# EAGLE schematic board (EAGLE 6.4)
Assembly variants: test
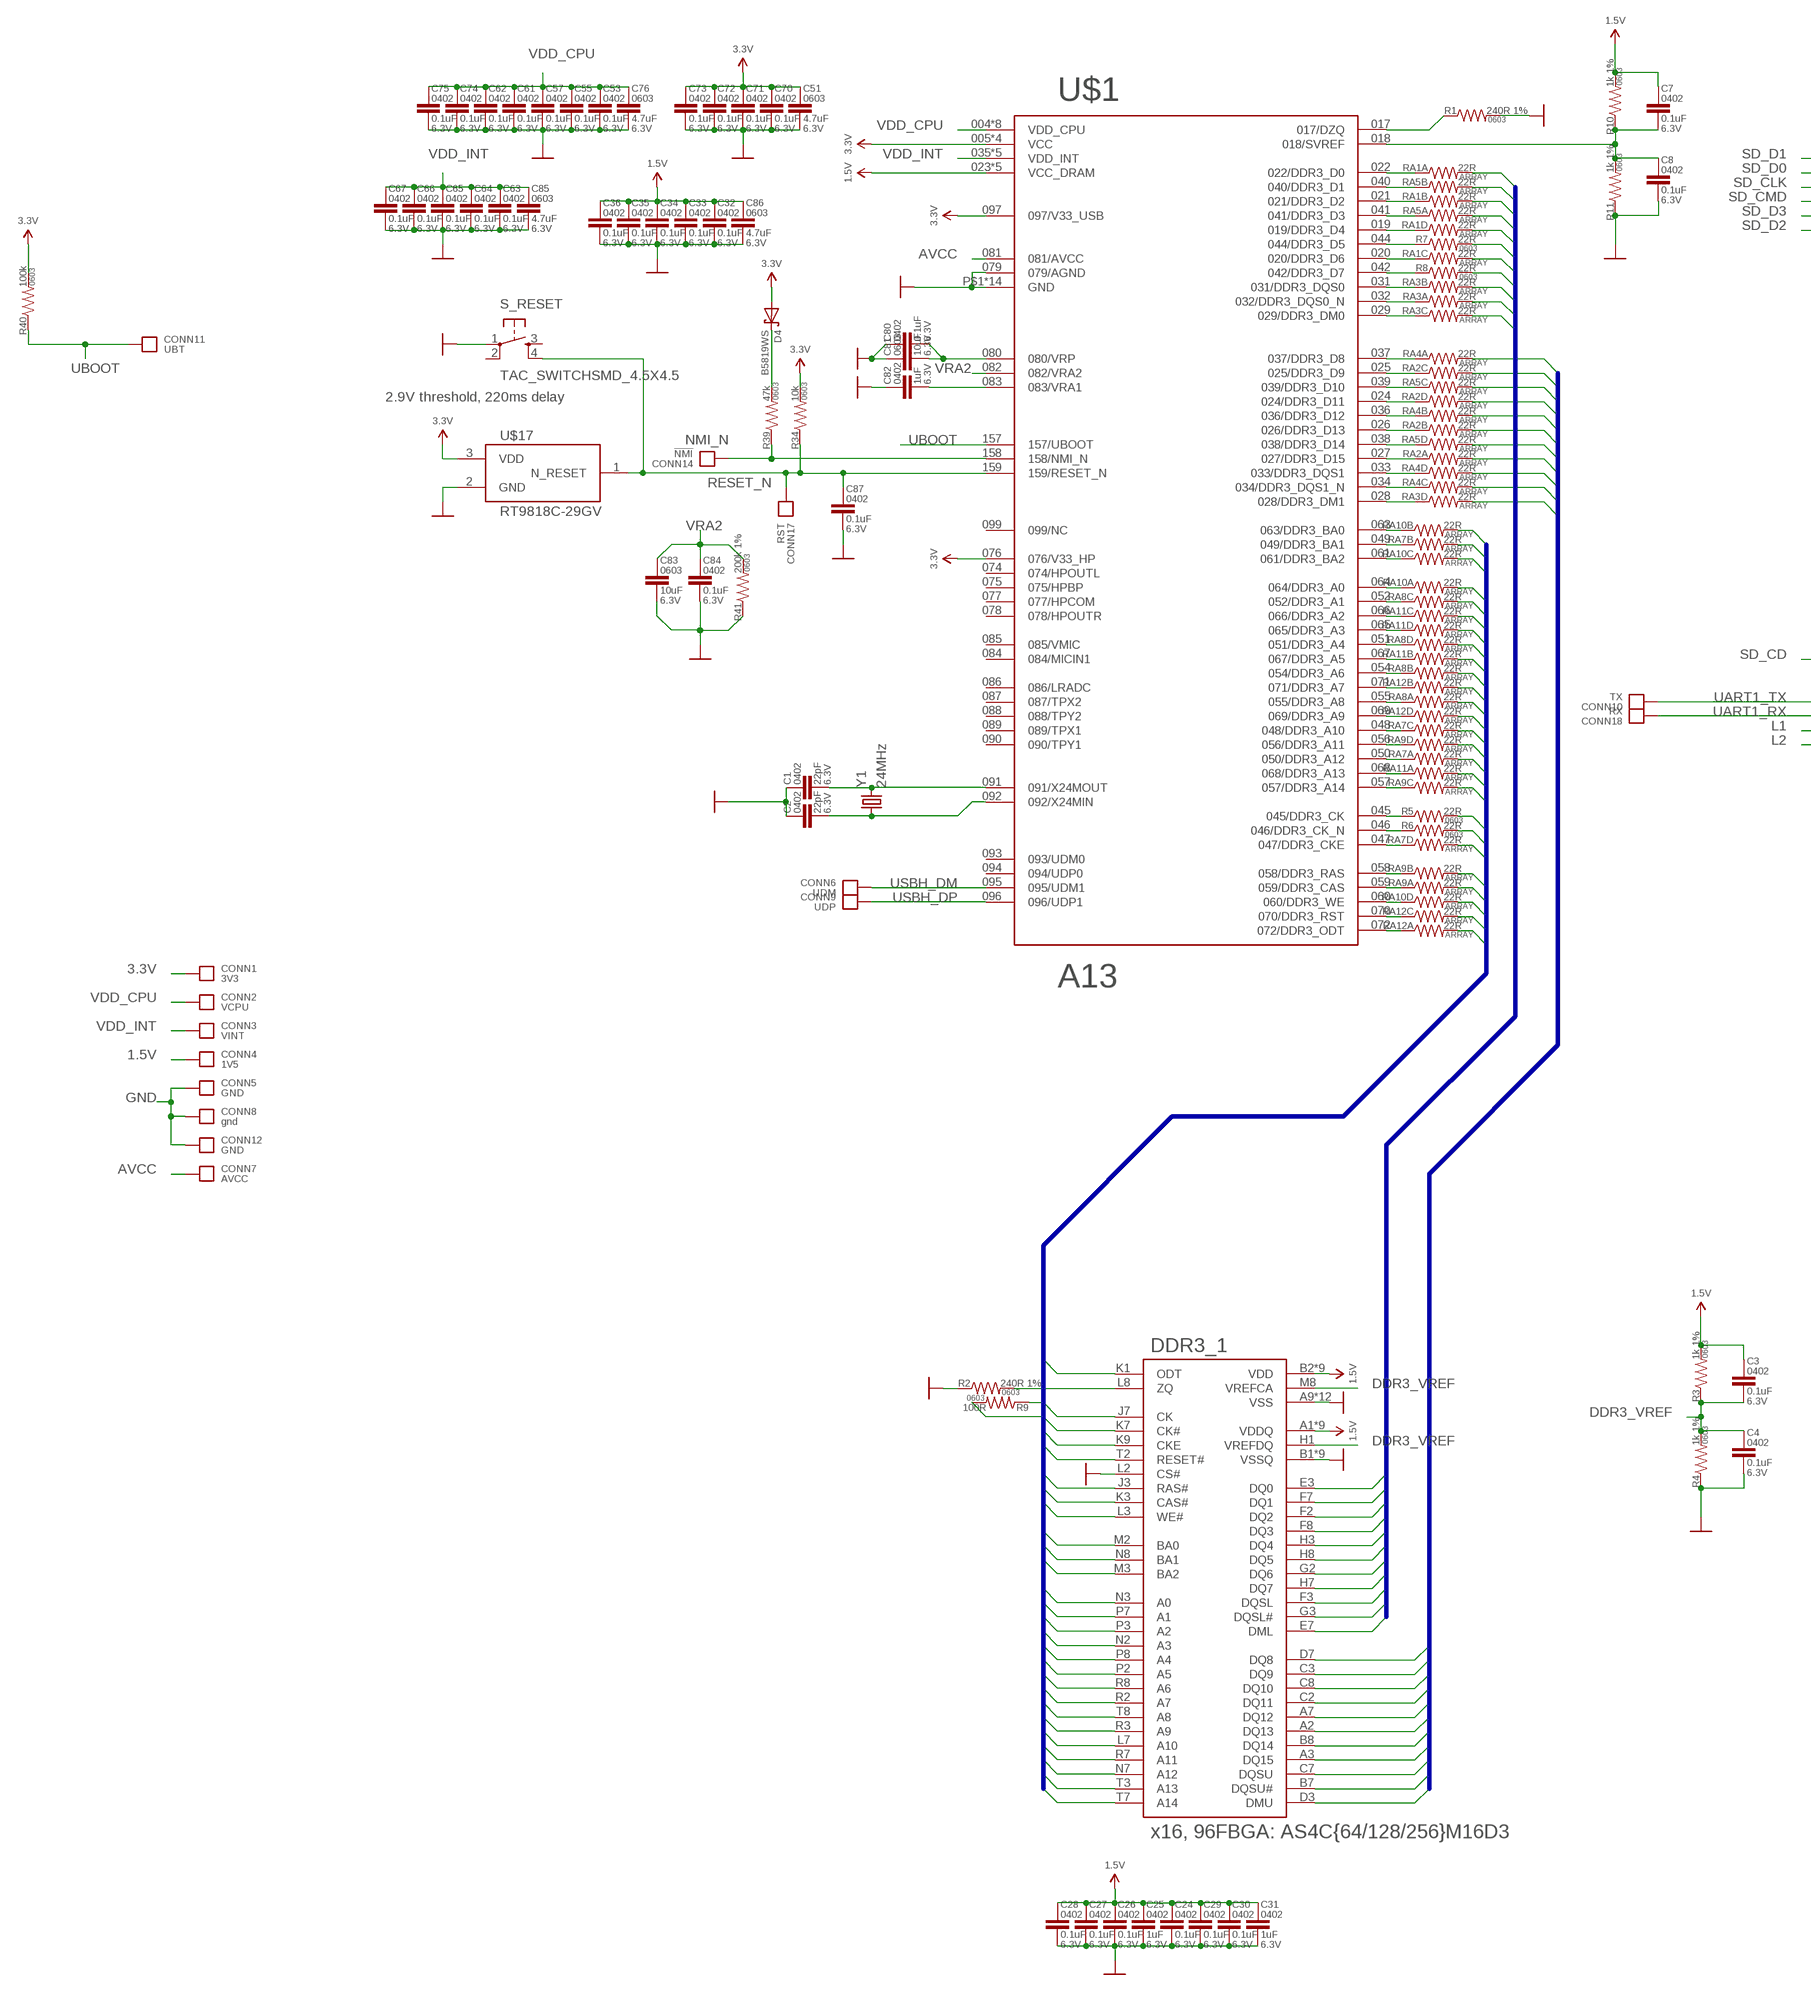
[diagram p0: schematic, sheet 1, part 1 of 2]
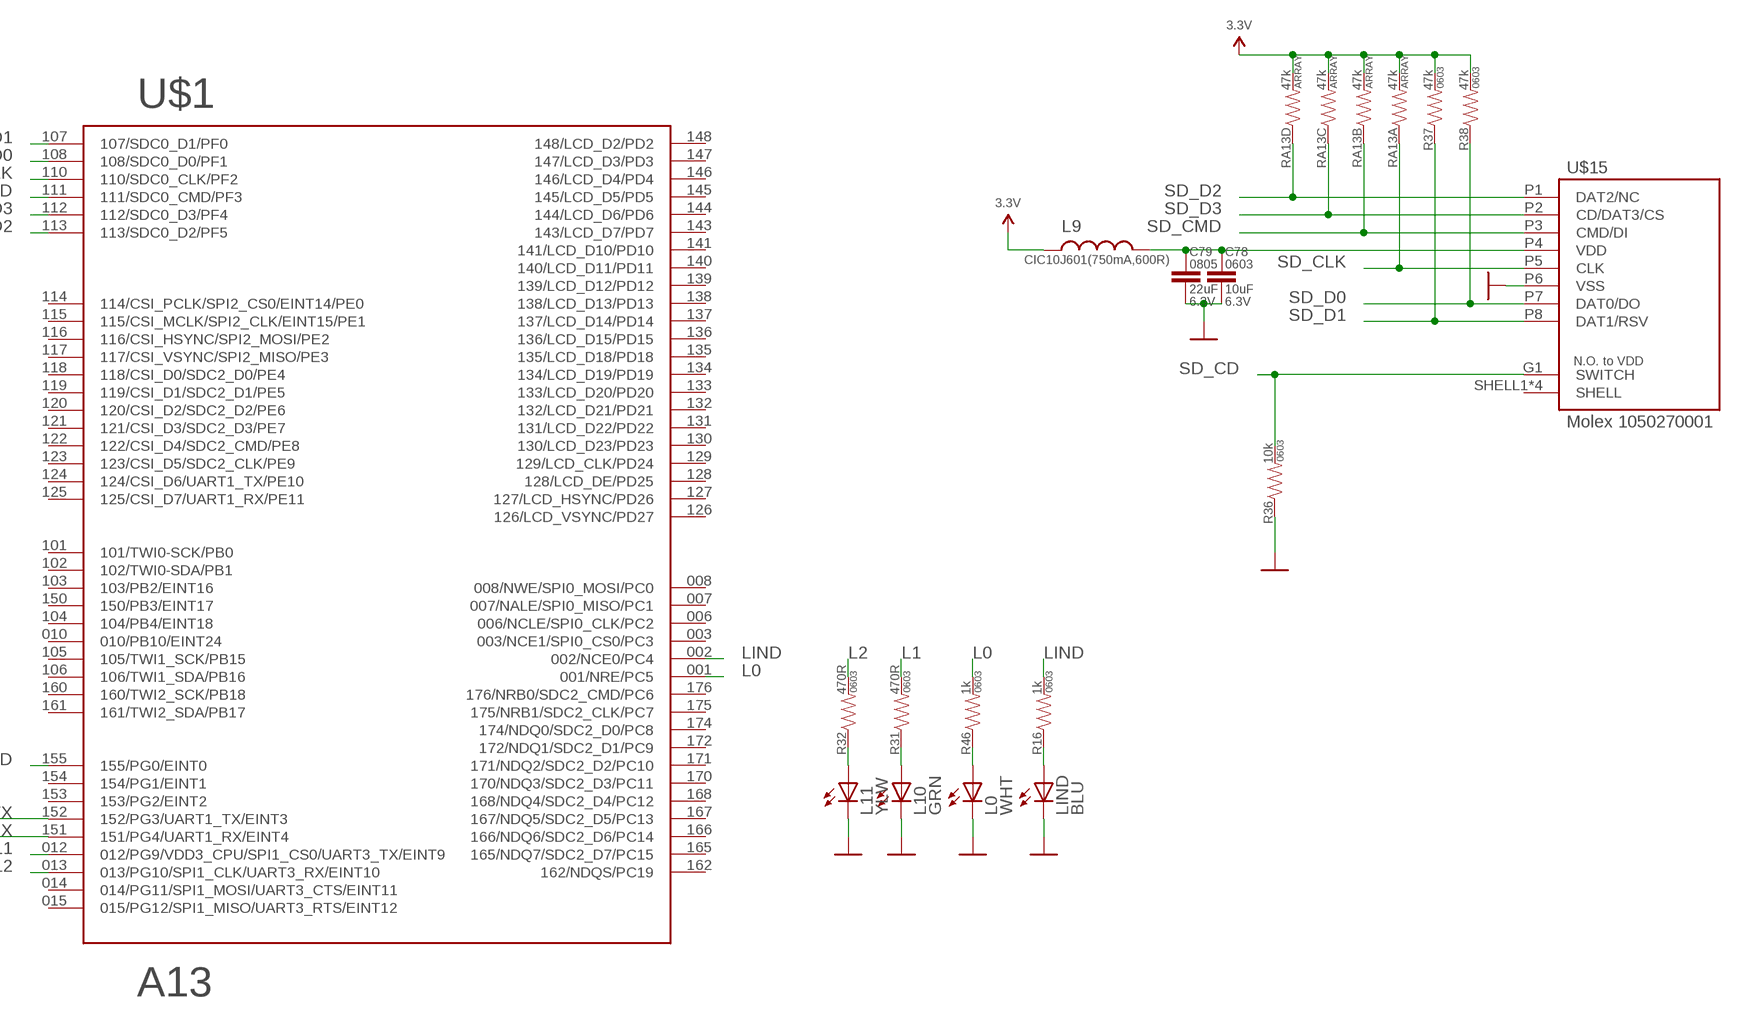
[diagram p1: schematic, sheet 1, part 2 of 2]

## Parts
C1  22pF  CAP0402-CAP  [0402-CAP]
C2  22pF  CAP0402-CAP  [0402-CAP]
C3  0.1uF  CAP0402-CAP  [0402-CAP]
C4  0.1uF  CAP0402-CAP  [0402-CAP]
C7  0.1uF  CAP0402-CAP  [0402-CAP]
C8  0.1uF  CAP0402-CAP  [0402-CAP]
C24  0.1uF  CAP0402-CAP  [0402-CAP]
C25  1uF  CAP0402-CAP  [0402-CAP]
C26  0.1uF  CAP0402-CAP  [0402-CAP]
C27  0.1uF  CAP0402-CAP  [0402-CAP]
C28  0.1uF  CAP0402-CAP  [0402-CAP]
C29  0.1uF  CAP0402-CAP  [0402-CAP]
C30  0.1uF  CAP0402-CAP  [0402-CAP]
C31  1uF  CAP0402-CAP  [0402-CAP]
C32  0.1uF  CAP0402-CAP  [0402-CAP]
C33  0.1uF  CAP0402-CAP  [0402-CAP]
C34  0.1uF  CAP0402-CAP  [0402-CAP]
C35  0.1uF  CAP0402-CAP  [0402-CAP]
C36  0.1uF  CAP0402-CAP  [0402-CAP]
C51  4.7uF  CAP0603  [0603-CAP]
C53  0.1uF  CAP0402-CAP  [0402-CAP]
C55  0.1uF  CAP0402-CAP  [0402-CAP]
C57  0.1uF  CAP0402-CAP  [0402-CAP]
C61  0.1uF  CAP0402-CAP  [0402-CAP]
C62  0.1uF  CAP0402-CAP  [0402-CAP]
C63  0.1uF  CAP0402-CAP  [0402-CAP]
C64  0.1uF  CAP0402-CAP  [0402-CAP]
C65  0.1uF  CAP0402-CAP  [0402-CAP]
C66  0.1uF  CAP0402-CAP  [0402-CAP]
C67  0.1uF  CAP0402-CAP  [0402-CAP]
C70  0.1uF  CAP0402-CAP  [0402-CAP]
C71  0.1uF  CAP0402-CAP  [0402-CAP]
C72  0.1uF  CAP0402-CAP  [0402-CAP]
C73  0.1uF  CAP0402-CAP  [0402-CAP]
C74  0.1uF  CAP0402-CAP  [0402-CAP]
C75  0.1uF  CAP0402-CAP  [0402-CAP]
C76  4.7uF  CAP0603  [0603-CAP]
C78  10uF  CAP0603  [0603-CAP]
C79  22uF  CAP0805  [0805-CAP]
C80  0.1uF  CAP0402-CAP  [0402-CAP]
C81  10uF  CAP0603  [0603-CAP]
C82  1uF  CAP0402-CAP  [0402-CAP]
C83  10uF  CAP0603  [0603-CAP]
C84  0.1uF  CAP0402-CAP  [0402-CAP]
C85  4.7uF  CAP0603  [0603-CAP]
C86  4.7uF  CAP0603  [0603-CAP]
C87  0.1uF  CAP0402-CAP  [0402-CAP]
CONN1  3V3  CONNECTOR22AWG  [HOLE_22AWG]
CONN2  VCPU  CONNECTOR22AWG  [HOLE_22AWG]
CONN3  VINT  CONNECTOR22AWG  [HOLE_22AWG]
CONN4  1V5  CONNECTOR22AWG  [HOLE_22AWG]
CONN5  GND  CONNECTOR22AWG  [HOLE_22AWG]
CONN6  UDM  CONNECTOR22AWG  [HOLE_22AWG]
CONN7  AVCC  CONNECTOR22AWG  [HOLE_22AWG]
CONN8  gnd  CONNECTORCLIP  [CLIP-AREA]
CONN9  UDP  CONNECTOR22AWG  [HOLE_22AWG]
CONN10  TX  CONNECTOR22AWG  [HOLE_22AWG]
CONN11  UBT  CONNECTOR22AWG  [HOLE_22AWG]
CONN12  GND  CONNECTOR22AWG  [HOLE_22AWG]
CONN14  !NMI  CONNECTOR22AWG  [HOLE_22AWG]
CONN17  RST  CONNECTOR22AWG  [HOLE_22AWG]
CONN18  RX  CONNECTOR22AWG  [HOLE_22AWG]
D4  B5819WS  DIODE-SCHOTTKYSOD323  [SOD-323]
DDR3_1  x16, 96FBGA: AS4C{64/128/256}M16D3  DDR3X16  [BGA96]
L0  WHT  LED0603  [0603_LED]
L9  CIC10J601(750mA,600R)  INDUCTOR0603  [0603]
L10  GRN  LED0603  [0603_LED]
L11  YLW  LED0603  [0603_LED]
LIND  BLU  LED0603  [0603_LED]
R1  240R 1%  RESISTOR0603  [0603-RES]
R2  240R 1%  RESISTOR0603  [0603-RES]
R3  1k 1%  RESISTOR0603  [0603-RES]
R4  1k 1%  RESISTOR0603  [0603-RES]
R5  22R  RESISTOR0603  [0603-RES]
R6  22R  RESISTOR0603  [0603-RES]
R7  22R  RESISTOR0603  [0603-RES]
R8  22R  RESISTOR0603  [0603-RES]
R9  100R  RESISTOR0603  [0603-RES]
R10  1k 1%  RESISTOR0603  [0603-RES]
R11  1k 1%  RESISTOR0603  [0603-RES]
R16  1k  RESISTOR0603  [0603-RES]
R31  470R  RESISTOR0603  [0603-RES]
R32  470R  RESISTOR0603  [0603-RES]
R34  10k  RESISTOR0603  [0603-RES]
R36  10k  RESISTOR0603  [0603-RES]
R37  47k  RESISTOR0603  [0603-RES]
R38  47k  RESISTOR0603  [0603-RES]
R39  47k  RESISTOR0603  [0603-RES]
R40  100k  RESISTOR0603  [0603-RES]
R41  200k 1%  RESISTOR0603  [0603-RES]
R46  1k  RESISTOR0603  [0603-RES]
RA1  22R  RESISTOR_ARRAY0603_X4  [0603-ARV]
RA2  22R  RESISTOR_ARRAY0603_X4  [0603-ARV]
RA3  22R  RESISTOR_ARRAY0603_X4  [0603-ARV]
RA4  22R  RESISTOR_ARRAY0603_X4  [0603-ARV]
RA5  22R  RESISTOR_ARRAY0603_X4  [0603-ARV]
RA7  22R  RESISTOR_ARRAY0603_X4  [0603-ARV]
RA8  22R  RESISTOR_ARRAY0603_X4  [0603-ARV]
RA9  22R  RESISTOR_ARRAY0603_X4  [0603-ARV]
RA10  22R  RESISTOR_ARRAY0603_X4  [0603-ARV]
RA11  22R  RESISTOR_ARRAY0603_X4  [0603-ARV]
RA12  22R  RESISTOR_ARRAY0603_X4  [0603-ARV]
RA13  47k  RESISTOR_ARRAY0603_X4  [0603-ARV]
S_RESET  TAC_SWITCHSMD_4.5X4.5  [TAC_SWITCH_SMD_4.5X4.5]
U$1  A13  [TQFP176_0.4]
U$15  Molex 1050270001  MICROSDMOLEX-1050270001  [MICROSD-MOLEX-1050270001]
U$17  RT9818C-29GV  POR_ACTIVE_LOW  [SOT23-3]
Y1  24MHz  CRYSTALHC49US  [HC49US]

## Nets
1.5V: C3.1 C7.1 C24.1 C25.1 C26.1 C27.1 C28.1 C29.1 C30.1 C31.1 C32.1 C33.1 C34.1 C35.1 C36.1 C86.1 CONN4.P DDR3_1.A1(VDDQ) DDR3_1.A8(VDDQ) DDR3_1.B2(VDD) DDR3_1.C1(VDDQ) DDR3_1.C9(VDDQ) DDR3_1.D2(VDDQ) DDR3_1.D9(VDD) DDR3_1.E9(VDDQ) DDR3_1.F1(VDDQ) DDR3_1.G7(VDD) DDR3_1.H2(VDDQ) DDR3_1.H9(VDDQ) DDR3_1.K2(VDD) DDR3_1.K8(VDD) DDR3_1.N1(VDD) DDR3_1.N9(VDD) DDR3_1.R1(VDD) DDR3_1.R9(VDD) R3.2 R10.2 U$1.023(VCC_DRAM) U$1.030(VCC_DRAM) U$1.043(VCC_DRAM) U$1.053(VCC_DRAM) U$1.062(VCC_DRAM)
3.3V: C51.1 C70.1 C71.1 C72.1 C73.1 CONN1.P D4.A L9.1 R34.2 R37.2 R38.2 R40.2 RA13.5 RA13.6 RA13.7 RA13.8 U$1.005(VCC) U$1.076(076/V33_HP) U$1.097(097/V33_USB) U$1.100(VCC) U$1.142(VCC) U$1.163(VCC) U$17.3(VDD)
AVCC: CONN7.P U$1.081(081/AVCC)
DDR3_A0: DDR3_1.N3(A0) RA10.8
DDR3_A1: DDR3_1.P7(A1) RA8.6
DDR3_A2: DDR3_1.P3(A2) RA11.6
DDR3_A3: DDR3_1.N2(A3) RA11.5
DDR3_A4: DDR3_1.P8(A4) RA8.5
DDR3_A5: DDR3_1.P2(A5) RA11.7
DDR3_A6: DDR3_1.R8(A6) RA8.7
DDR3_A7: DDR3_1.R2(A7) RA12.7
DDR3_A8: DDR3_1.T8(A8) RA8.8
DDR3_A9: DDR3_1.R3(A9) RA12.5
DDR3_A10: DDR3_1.L7(A10) RA7.6
DDR3_A11: DDR3_1.R7(A11) RA9.5
DDR3_A12: DDR3_1.N7(A12) RA7.8
DDR3_A13: DDR3_1.T3(A13) RA11.8
DDR3_A14: DDR3_1.T7(A14) RA9.6
DDR3_BA0: DDR3_1.M2(BA0) RA10.7
DDR3_BA1: DDR3_1.N8(BA1) RA7.7
DDR3_BA2: DDR3_1.M3(BA2) RA10.6
DDR3_CAS: DDR3_1.K3(CAS#) RA9.8
DDR3_CK: DDR3_1.J7(CK) R5.2 R9.1
DDR3_CK#: DDR3_1.K7(CK#) R6.2 R9.2
DDR3_CKE: DDR3_1.K9(CKE) RA7.5
DDR3_DML: DDR3_1.E7(DML) RA3.6
DDR3_DMU: DDR3_1.D3(DMU) RA3.5
DDR3_DQ0: DDR3_1.E3(DQ0) RA1.8
DDR3_DQ1: DDR3_1.F7(DQ1) RA5.7
DDR3_DQ2: DDR3_1.F2(DQ2) RA1.7
DDR3_DQ3: DDR3_1.F8(DQ3) RA5.8
DDR3_DQ4: DDR3_1.H3(DQ4) RA1.5
DDR3_DQ5: DDR3_1.H8(DQ5) R7.2
DDR3_DQ6: DDR3_1.G2(DQ6) RA1.6
DDR3_DQ7: DDR3_1.H7(DQ7) R8.2
DDR3_DQ8: DDR3_1.D7(DQ8) RA4.8
DDR3_DQ9: DDR3_1.C3(DQ9) RA2.6
DDR3_DQ10: DDR3_1.C8(DQ10) RA5.6
DDR3_DQ11: DDR3_1.C2(DQ11) RA2.5
DDR3_DQ12: DDR3_1.A7(DQ12) RA4.7
DDR3_DQ13: DDR3_1.A2(DQ13) RA2.7
DDR3_DQ14: DDR3_1.B8(DQ14) RA5.5
DDR3_DQ15: DDR3_1.A3(DQ15) RA2.8
DDR3_DQSL: DDR3_1.F3(DQSL) RA3.7
DDR3_DQSL#: DDR3_1.G3(DQSL#) RA3.8
DDR3_DQSU: DDR3_1.C7(DQSU) RA4.5
DDR3_DQSU#: DDR3_1.B7(DQSU#) RA4.6
DDR3_ODT: DDR3_1.K1(ODT) RA12.8
DDR3_RAS: DDR3_1.J3(RAS#) RA9.7
DDR3_RST: DDR3_1.T2(RESET#) RA12.6
DDR3_VREF: C3.2 C4.1 DDR3_1.H1(VREFDQ) DDR3_1.M8(VREFCA) R3.1 R4.2
DDR3_WE: DDR3_1.L3(WE#) RA10.5
GND: C1.1 C2.1 C4.2 C8.2 C24.2 C25.2 C26.2 C27.2 C28.2 C29.2 C30.2 C31.2 C32.2 C33.2 C34.2 C35.2 C36.2 C51.2 C53.2 C55.2 C57.2 C61.2 C62.2 C63.2 C64.2 C65.2 C66.2 C67.2 C70.2 C71.2 C72.2 C73.2 C74.2 C75.2 C76.2 C78.2 C79.2 C80.1 C81.1 C82.1 C83.2 C84.2 C85.2 C86.2 C87.2 CONN5.P CONN8.P$1(P) CONN8.P$2(P) CONN12.P DDR3_1.A9(VSS) DDR3_1.B1(VSSQ) DDR3_1.B3(VSS) DDR3_1.B9(VSSQ) DDR3_1.D1(VSSQ) DDR3_1.D8(VSSQ) DDR3_1.E1(VSS) DDR3_1.E2(VSSQ) DDR3_1.E8(VSSQ) DDR3_1.F9(VSSQ) DDR3_1.G1(VSSQ) DDR3_1.G8(VSS) DDR3_1.G9(VSSQ) DDR3_1.J2(VSS) DDR3_1.J8(VSS) DDR3_1.L2(CS#) DDR3_1.M1(VSS) DDR3_1.M9(VSS) DDR3_1.P1(VSS) DDR3_1.P9(VSS) DDR3_1.T1(VSS) DDR3_1.T9(VSS) L0.C L10.C L11.C LIND.C R1.2 R2.1 R4.1 R11.1 R36.1 R41.1 S_RESET.1 U$1.079(079/AGND) U$1.P$1(GND) U$1.P$2(GND) U$1.P$3(GND) U$1.P$4(GND) U$1.P$5(GND) U$1.P$6(GND) U$1.P$7(GND) U$1.P$8(GND) U$1.P$9(GND) U$1.P$10(GND) U$1.P$11(GND) U$1.P$12(GND) U$1.P$13(GND) U$1.PAD(GND) U$15.P6(VSS) U$17.2(GND)
L0: R46.2 U$1.001(001/NRE/PC5)
L1: R31.2 U$1.012(012/PG9/VDD3_CPU/SPI1_CS0/UART3_TX/EINT9)
L2: R32.2 U$1.013(013/PG10/SPI1_CLK/UART3_RX/EINT10)
LIND: R16.2 U$1.002(002/NCE0/PC4)
N$1: R1.1 U$1.017(017/DZQ)
N$2: RA1.3 U$1.020(020/DDR3_D6)
N$3: C1.2 U$1.091(091/X24MOUT) Y1.2
N$4: C2.2 U$1.092(092/X24MIN) Y1.1
N$5: RA1.4 U$1.019(019/DDR3_D4)
N$6: DDR3_1.L8(ZQ) R2.2
N$7: RA3.4 U$1.028(028/DDR3_DM1)
N$8: RA4.3 U$1.034(034/DDR3_DQS1_N)
N$9: RA4.4 U$1.033(033/DDR3_DQS1)
N$10: RA2.1 U$1.027(027/DDR3_D15)
N$11: RA5.4 U$1.038(038/DDR3_D14)
N$12: RA2.2 U$1.026(026/DDR3_D13)
N$13: RA4.2 U$1.036(036/DDR3_D12)
N$14: RA2.4 U$1.024(024/DDR3_D11)
N$15: RA5.3 U$1.039(039/DDR3_D10)
N$16: RA2.3 U$1.025(025/DDR3_D9)
N$17: RA4.1 U$1.037(037/DDR3_D8)
N$18: RA3.3 U$1.029(029/DDR3_DM0)
N$19: RA3.1 U$1.032(032/DDR3_DQS0_N)
N$20: RA3.2 U$1.031(031/DDR3_DQS0)
N$21: R8.1 U$1.042(042/DDR3_D7)
N$22: R7.1 U$1.044(044/DDR3_D5)
N$23: RA5.1 U$1.041(041/DDR3_D3)
N$24: RA1.2 U$1.021(021/DDR3_D2)
N$25: RA5.2 U$1.040(040/DDR3_D1)
N$26: RA1.1 U$1.022(022/DDR3_D0)
N$27: RA10.2 U$1.063(063/DDR3_BA0)
N$28: RA7.2 U$1.049(049/DDR3_BA1)
N$29: RA10.3 U$1.061(061/DDR3_BA2)
N$30: RA10.1 U$1.064(064/DDR3_A0)
N$31: RA8.3 U$1.052(052/DDR3_A1)
N$32: RA11.3 U$1.066(066/DDR3_A2)
N$33: RA11.4 U$1.065(065/DDR3_A3)
N$34: RA8.4 U$1.051(051/DDR3_A4)
N$35: RA11.2 U$1.067(067/DDR3_A5)
N$36: RA8.2 U$1.054(054/DDR3_A6)
N$37: RA12.2 U$1.071(071/DDR3_A7)
N$38: RA8.1 U$1.055(055/DDR3_A8)
N$39: RA12.4 U$1.069(069/DDR3_A9)
N$40: RA7.3 U$1.048(048/DDR3_A10)
N$41: RA9.4 U$1.056(056/DDR3_A11)
N$42: RA7.1 U$1.050(050/DDR3_A12)
N$43: RA11.1 U$1.068(068/DDR3_A13)
N$44: RA9.3 U$1.057(057/DDR3_A14)
N$45: R5.1 U$1.045(045/DDR3_CK)
N$46: R6.1 U$1.046(046/DDR3_CK_N)
N$47: RA7.4 U$1.047(047/DDR3_CKE)
N$48: RA9.2 U$1.058(058/DDR3_RAS)
N$49: RA9.1 U$1.059(059/DDR3_CAS)
N$50: RA10.4 U$1.060(060/DDR3_WE)
N$51: RA12.3 U$1.070(070/DDR3_RST)
N$52: RA12.1 U$1.072(072/DDR3_ODT)
N$66: LIND.A R16.1
N$79: L10.A R31.1
N$84: L11.A R32.1
N$93: D4.C R39.2
N$108: C78.1 C79.1 L9.2 U$15.P4(VDD)
N$109: L0.A R46.1
NMI_N: CONN14.P R39.1 U$1.158(158/NMI_N)
RESET_N: C87.1 CONN17.P R34.1 S_RESET.4 U$1.159(159/RESET_N) U$17.1(N_RESET)
SD_CD: R36.2 U$1.155(155/PG0/EINT0) U$15.G1(SWITCH)
SD_CLK: RA13.1 U$1.110(110/SDC0_CLK/PF2) U$15.P5(CLK)
SD_CMD: RA13.2 U$1.111(111/SDC0_CMD/PF3) U$15.P3(CMD/DI)
SD_D0: R38.1 U$1.108(108/SDC0_D0/PF1) U$15.P7(DAT0/DO)
SD_D1: R37.1 U$1.107(107/SDC0_D1/PF0) U$15.P8(DAT1/RSV)
SD_D2: RA13.4 U$1.113(113/SDC0_D2/PF5) U$15.P1(DAT2/NC)
SD_D3: RA13.3 U$1.112(112/SDC0_D3/PF4) U$15.P2(CD/DAT3/CS)
SVREF: C7.2 C8.1 R10.1 R11.2 U$1.018(018/SVREF)
UART1_RX: CONN18.P U$1.151(151/PG4/UART1_RX/EINT4)
UART1_TX: CONN10.P U$1.152(152/PG3/UART1_TX/EINT3)
UBOOT: CONN11.P R40.1 U$1.157(157/UBOOT)
USBH_DM: CONN6.P U$1.095(095/UDM1)
USBH_DP: CONN9.P U$1.096(096/UDP1)
VDD_CPU: C53.1 C55.1 C57.1 C61.1 C62.1 C74.1 C75.1 C76.1 CONN2.P U$1.004(VDD_CPU) U$1.009(VDD_CPU) U$1.011(VDD_CPU) U$1.016(VDD_CPU) U$1.156(VDD_CPU) U$1.164(VDD_CPU) U$1.169(VDD_CPU) U$1.173(VDD_CPU)
VDD_INT: C63.1 C64.1 C65.1 C66.1 C67.1 C85.1 CONN3.P U$1.035(VDD_INT) U$1.073(VDD_INT) U$1.098(VDD_INT) U$1.109(VDD_INT) U$1.149(VDD_INT)
VRA1: C82.2 U$1.083(083/VRA1)
VRA2: C83.1 C84.1 R41.2 U$1.082(082/VRA2)
VRP: C80.2 C81.2 U$1.080(080/VRP)
Unconnected: S_RESET.2 S_RESET.3 U$1.003(003/NCE1/SPI0_CS0/PC3) U$1.006(006/NCLE/SPI0_CLK/PC2) U$1.007(007/NALE/SPI0_MISO/PC1) U$1.008(008/NWE/SPI0_MOSI/PC0) U$1.010(010/PB10/EINT24) U$1.014(014/PG11/SPI1_MOSI/UART3_CTS/EINT11) U$1.015(015/PG12/SPI1_MISO/UART3_RTS/EINT12) U$1.074(074/HPOUTL) U$1.075(075/HPBP) U$1.077(077/HPCOM) U$1.078(078/HPOUTR) U$1.084(084/MICIN1) U$1.085(085/VMIC) U$1.086(086/LRADC) U$1.087(087/TPX2) U$1.088(088/TPY2) U$1.089(089/TPX1) U$1.090(090/TPY1) U$1.093(093/UDM0) U$1.094(094/UDP0) U$1.099(099/NC) U$1.101(101/TWI0-SCK/PB0) U$1.102(102/TWI0-SDA/PB1) U$1.103(103/PB2/EINT16) U$1.104(104/PB4/EINT18) U$1.105(105/TWI1_SCK/PB15) U$1.106(106/TWI1_SDA/PB16) U$1.114(114/CSI_PCLK/SPI2_CS0/EINT14/PE0) U$1.115(115/CSI_MCLK/SPI2_CLK/EINT15/PE1) U$1.116(116/CSI_HSYNC/SPI2_MOSI/PE2) U$1.117(117/CSI_VSYNC/SPI2_MISO/PE3) U$1.118(118/CSI_D0/SDC2_D0/PE4) U$1.119(119/CSI_D1/SDC2_D1/PE5) U$1.120(120/CSI_D2/SDC2_D2/PE6) U$1.121(121/CSI_D3/SDC2_D3/PE7) U$1.122(122/CSI_D4/SDC2_CMD/PE8) U$1.123(123/CSI_D5/SDC2_CLK/PE9) U$1.124(124/CSI_D6/UART1_TX/PE10) U$1.125(125/CSI_D7/UART1_RX/PE11) U$1.126(126/LCD_VSYNC/PD27) U$1.127(127/LCD_HSYNC/PD26) U$1.128(128/LCD_DE/PD25) U$1.129(129/LCD_CLK/PD24) U$1.130(130/LCD_D23/PD23) U$1.131(131/LCD_D22/PD22) U$1.132(132/LCD_D21/PD21) U$1.133(133/LCD_D20/PD20) U$1.134(134/LCD_D19/PD19) U$1.135(135/LCD_D18/PD18) U$1.136(136/LCD_D15/PD15) U$1.137(137/LCD_D14/PD14) U$1.138(138/LCD_D13/PD13) U$1.139(139/LCD_D12/PD12) U$1.140(140/LCD_D11/PD11) U$1.141(141/LCD_D10/PD10) U$1.143(143/LCD_D7/PD7) U$1.144(144/LCD_D6/PD6) U$1.145(145/LCD_D5/PD5) U$1.146(146/LCD_D4/PD4) U$1.147(147/LCD_D3/PD3) U$1.148(148/LCD_D2/PD2) U$1.150(150/PB3/EINT17) U$1.153(153/PG2/EINT2) U$1.154(154/PG1/EINT1) U$1.160(160/TWI2_SCK/PB18) U$1.161(161/TWI2_SDA/PB17) U$1.162(162/NDQS/PC19) U$1.165(165/NDQ7/SDC2_D7/PC15) U$1.166(166/NDQ6/SDC2_D6/PC14) U$1.167(167/NDQ5/SDC2_D5/PC13) U$1.168(168/NDQ4/SDC2_D4/PC12) U$1.170(170/NDQ3/SDC2_D3/PC11) U$1.171(171/NDQ2/SDC2_D2/PC10) U$1.172(172/NDQ1/SDC2_D1/PC9) U$1.174(174/NDQ0/SDC2_D0/PC8) U$1.175(175/NRB1/SDC2_CLK/PC7) U$1.176(176/NRB0/SDC2_CMD/PC6) U$15.SHELL1(SHELL) U$15.SHELL2(SHELL) U$15.SHELL3(SHELL) U$15.SHELL4(SHELL)

## Buses
DDR3_DQ[0..7],DDR3_DQSL,DDR3_DQSL#,DDR3_DML
DDR3_DQ[8..15],DDR3_DQSU,DDR3_DQSU#,DDR3_DMU
DDR3_BA[0..2],DDR3_A[0..14],DDR3_CK,DDR3_CK#,DDR3_CKE,DDR3_RAS,DDR3_CAS,DDR3_WE,DDR3_RST,DDR3_ODT

## Notes on the sheet
- 2.9V threshold, 220ms delay

## Library data of the parts
C1-C4 C7 C8 C24-C36 C53 C55 C57 C61-C67 C70-C75 C80 C82 C84 C87 = kmod-passives:CAP: Capacitor Standard 0603 ceramic capacitor, and 0.1" leaded capacitor.; PACKAGE: 0402; VOLTAGE: 6.3V
C51 C76 C78 C81 C83 C85 C86 = kmod-passives:CAP: Capacitor Standard 0603 ceramic capacitor, and 0.1" leaded capacitor.; PACKAGE: 0603; VOLTAGE: 6.3V
C79 = kmod-passives:CAP: Capacitor Standard 0603 ceramic capacitor, and 0.1" leaded capacitor.; PACKAGE: 0805; VOLTAGE: 6.3V
CONN1-CONN12 CONN14 CONN17 CONN18 = kmod-nonparts:CONNECTOR: Collection of holes/pads for testing/connecting
D4 = kmod-discretesemi:DIODE-SCHOTTKY: Schottky diode
DDR3_1 = kmod-testing:DDR3X16: DDR3 x16 Based off a 4gb part
L0 L10 L11 LIND = kmod-passives:LED
L9 = kmod-passives:INDUCTOR
R1-R11 R16 R31 R32 R34 R36-R41 R46 = kmod-passives:RESISTOR: Resistor Basic schematic elements and footprints for 0603, 1206, and PTH resistors.; PACKAGE: 0603
RA1-RA5 RA7-RA13 = kmod-passives:RESISTOR_ARRAY; PACKAGE: ARRAY
S_RESET = kmod-mechanical:TAC_SWITCH: Momentary Switch Button commonly used for reset or general input. Spark Fun Electronics SKU : COM-00097 SMT- SWCH-08247
U$1 = kmod-testing:A13: Allwinner A13
U$15 = kmod-connectors:MICROSD; SWITCH_TYPE: N.O. to VDD
U$17 = kmod-ics:POR_ACTIVE_LOW: Power-on-reset unit with active-low reset. Make sure to check the pinouts -- there doesn't seem to be a standard one.
Y1 = kmod-mechanical:CRYSTAL: Various standard crystals. Proven footprints. Spark Fun Electronics SKU : COM-00534